# Altium schematic sheet Sheet1.SchDoc
size A4
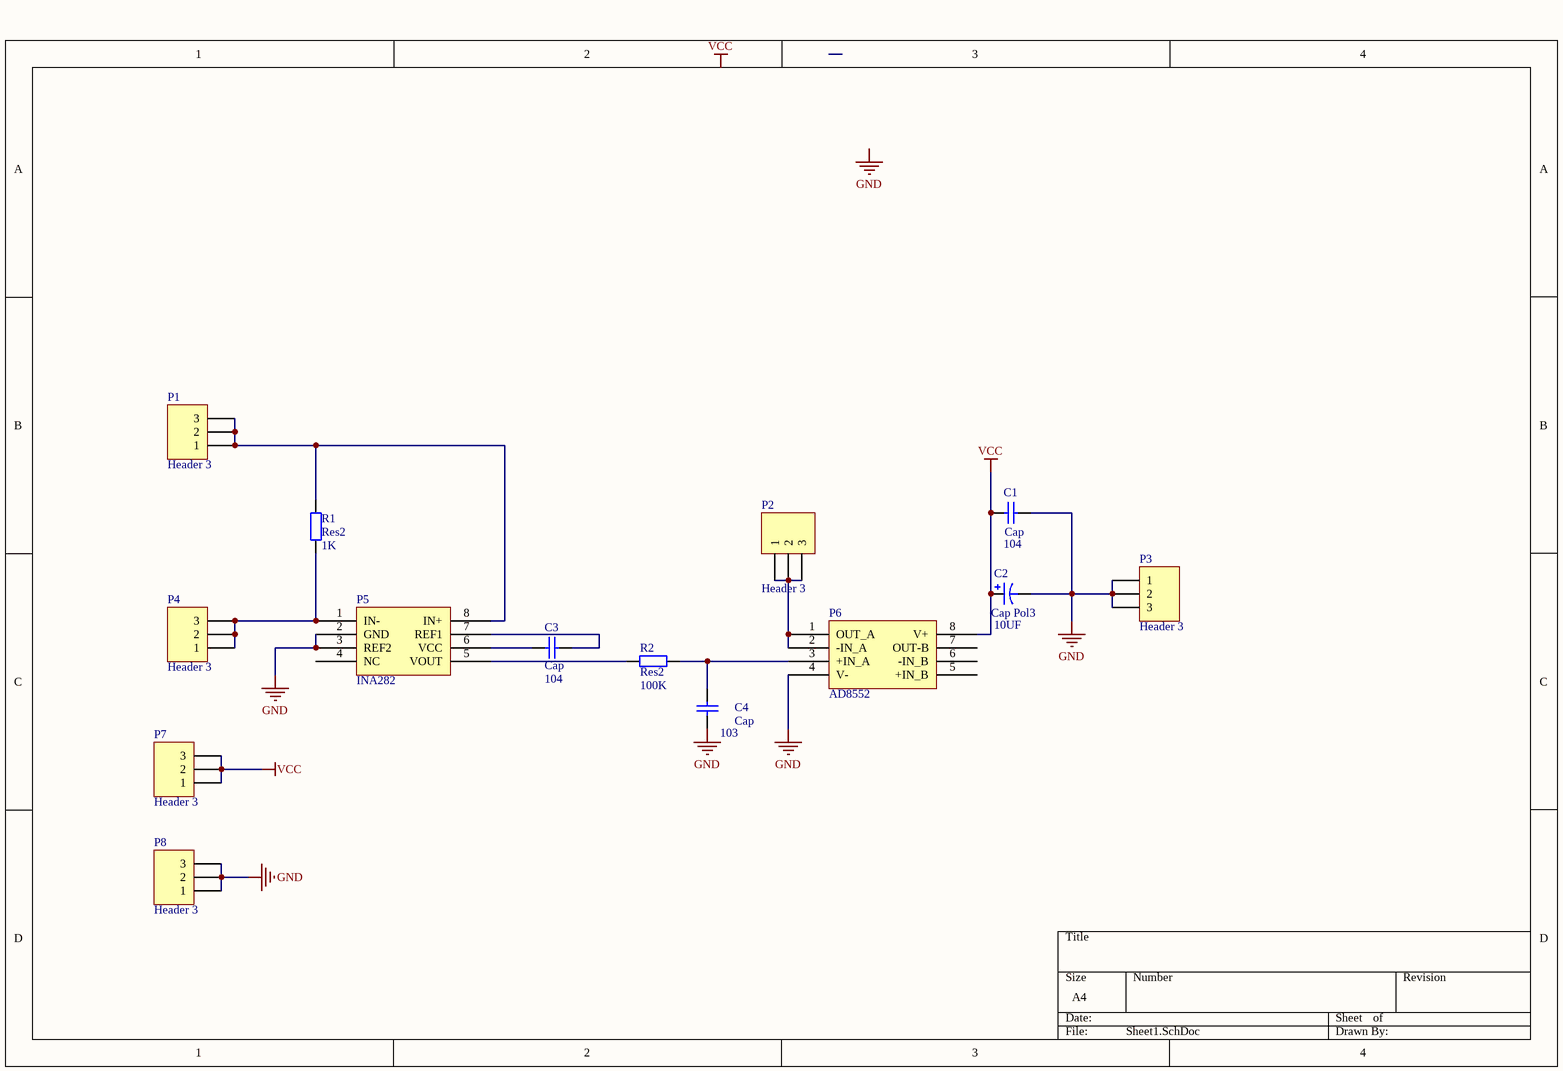
[diagram p0: Sheet1.SchDoc]

## Parts
C1  Cap  value 104  [BAT-2]
C2  Cap Pol3  value 10UF  [BAT-2]
C3  Cap  value 104  [BAT-2]
C4  Cap  value 103  [BAT-2]
P1  Header 3  [HDR1X3]
P2  Header 3  [HDR1X3]
P3  Header 3  [HDR1X3]
P4  Header 3  [HDR1X3]
P5  INA282  [DIP-8]
P6  AD8552  [DIP-8]
P7  Header 3  [HDR1X3]
P8  Header 3  [HDR1X3]
R1  Res2  value 1K  [C]
R2  Res2  value 100K  [AXIAL-0.4]

## Nets
GND: C1.2 C2.2 C4.2 P3.1 P3.2 P3.3 P5.2(GND) P5.3(REF2) P6.4(V-) P8.1 P8.2 P8.3
VCC: C1.1 C2.1 P6.8(V+) P7.1 P7.2 P7.3
NetC3_1: C3.1 P5.6(VCC)
NetC3_2: C3.2 P5.7(REF1)
NetC4_1: C4.1 P6.3(+IN_A) R2.2
NetP1_1: P1.1 P1.2 P1.3 P5.8(IN+) R1.2
NetP2_1: P2.1 P2.2 P2.3 P6.1(OUT_A) P6.2(-IN_A)
NetP4_1: P4.1 P4.2 P4.3 P5.1(IN-) R1.1
NetP5_5: P5.5(VOUT) R2.1

Not connected (* = marked no-connect by the designer): P5 4(NC); P6 5(+IN_B) 6(-IN_B) 7(OUT-B)

## Notes on the sheet
- Labels drawn without touching a wire or pin: GND, VCC

## Library data of the parts
C1 C3 C4 = Cap: Capacitor; Published: 8-Jun-2000; LatestRevisionDate: 17-Jul-2002; LatestRevisionNote: Re-released for DXP Platform.; PackageReference: RAD-0.3; Publisher: Altium Limited; PackageDescription: Radial Cap, Thru-Hole; 2 Leads; 0.3 in Pin Spacing
C2 = Cap Pol3: Polarized Capacitor (Surface Mount); Published: 8-Jun-2000; LatestRevisionDate: 29-May-2009; LatestRevisionNote: IPC-7351 Footprint Added.; PackageReference: C0805; Publisher: Altium Limited; PackageDescription: Chip Capacitor
P1-P4 P7 P8 = Header 3: Header, 3-Pin; LatestRevisionDate: 17-Jul-2002; LatestRevisionNote: Re-released for DXP Platform.; Publisher: Altium Limited
R1 R2 = Res2: Resistor; Published: 8-Jun-2000; LatestRevisionDate: 17-Jul-2002; LatestRevisionNote: Re-released for DXP Platform.; PackageReference: AXIAL-0.4; Publisher: Altium Limited; PackageDescription: Axial Device, Thru-Hole; 2 Leads; 0.4 in Pin Spacing